# EAGLE schematic Universal_Board_Side_Mount (EAGLE 9.6.2)
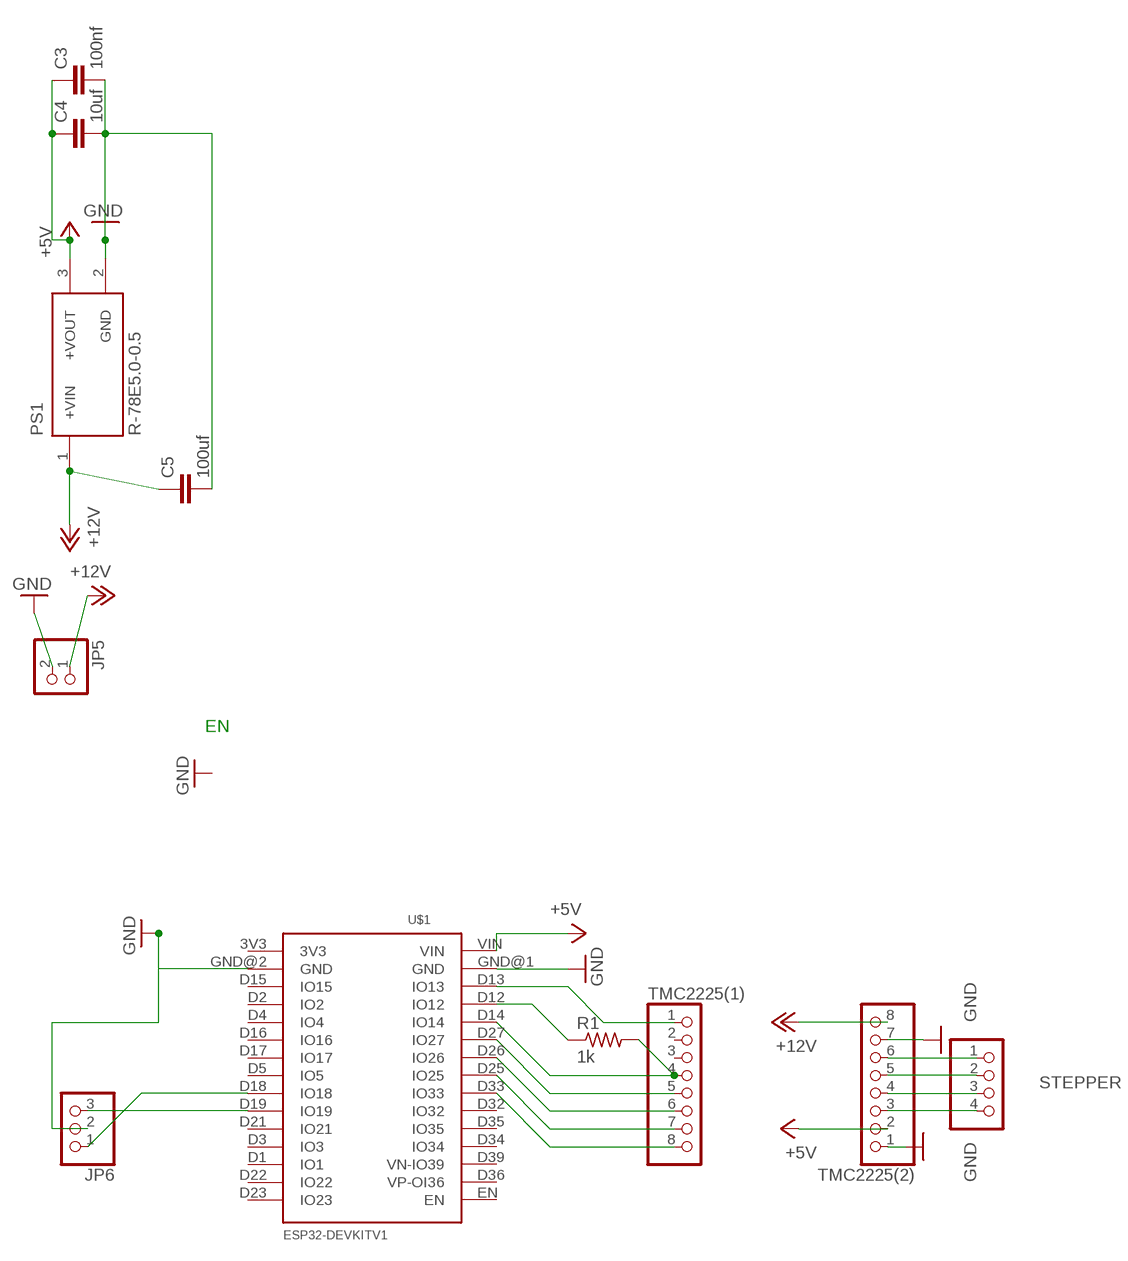
[diagram p0: schematic, sheet 1]

## Parts
C3  100nf  C2,5-3  [C2.5-3]
C4  10uf  C2,5-3  [C2.5-3]
C5  100uf  C2,5-3  [C2.5-3]
JP5  PINHD-1X2  [1X02]
JP6  PINHD-1X3  [1X03]
PS1  R-78E5.0-0.5  [CONV_R-78E5.0-0.5]
R1  1k  R-US_0204/7  [0204/7]
STEPPER  PINHD-1X4  [1X04]
TMC2225(1)  PINHD-1X8  [1X08]
TMC2225(2)  PINHD-1X8  [1X08]
U$1  ESP32DEVKITV1  [ESP32-DEVKITV1]

## Nets
+5V: C3.1 C4.1 PS1.3(+VOUT) TMC2225(2).2 U$1.VIN
+12V: C5.1 JP5.1 PS1.1(+VIN) TMC2225(2).8
GND: C3.2 C4.2 C5.2 JP5.2 JP6.2 PS1.2(GND) TMC2225(2).1 TMC2225(2).7 U$1.GND@1(GND) U$1.GND@2(GND)
N$1: R1.2 TMC2225(1).4 U$1.D14(IO14)
N$2: TMC2225(1).1 U$1.D13(IO13)
N$3: R1.1 U$1.D12(IO12)
N$4: TMC2225(1).5 U$1.D27(IO27)
N$5: TMC2225(1).6 U$1.D26(IO26)
N$6: TMC2225(1).7 U$1.D25(IO25)
N$7: TMC2225(1).8 U$1.D33(IO33)
N$8: STEPPER.1 TMC2225(2).6
N$9: STEPPER.2 TMC2225(2).5
N$10: STEPPER.3 TMC2225(2).4
N$11: STEPPER.4 TMC2225(2).3
N$13: JP6.3 U$1.D19(IO19)
N$15: JP6.1 U$1.D18(IO18)
Unconnected: TMC2225(1).2 TMC2225(1).3 U$1.3V3 U$1.D1(IO1) U$1.D2(IO2) U$1.D3(IO3) U$1.D4(IO4) U$1.D5(IO5) U$1.D15(IO15) U$1.D16(IO16) U$1.D17(IO17) U$1.D21(IO21) U$1.D22(IO22) U$1.D23(IO23) U$1.D32(IO32) U$1.D34(IO34) U$1.D35(IO35) U$1.D36(VP-OI36) U$1.D39(VN-IO39) U$1.EN

## Notes on the sheet
- EN

## Library data of the parts
C3-C5 = capacitor-wima:C: CAPACITOR naming: grid - package width
JP5 = pinhead:PINHD-1X2: PIN HEADER
JP6 = pinhead:PINHD-1X3: PIN HEADER
PS1 = R-78E5.0-0.5:R-78E5.0-0.5: 0.5 Amp SIP3 Single Output; DESCRIPTION: Switching regulator module - DC/DC converter . Single Output. 7.0V to 28.0V input voltage range and 5 V output voltage range; DIGI-KEY_PART_NUMBER: 945-1648-5-ND; MF: Recom Power; MP: R-78E5.0-0.5; PACKAGE: SIP-3 Recom Power; PURCHASE-URL: https://pricing.snapeda.com/search/part/R-78E5.0-0.5/?ref=eda
R1 = rcl:R-US_: RESISTOR, American symbol; SPICEPREFIX: R
STEPPER = pinhead:PINHD-1X4: PIN HEADER
TMC2225(1) TMC2225(2) = pinhead:PINHD-1X8: PIN HEADER
U$1 = ESP32-DEVKITV1:ESP32DEVKITV1